# Altium schematic sheet УШЯИ.467444.130Э3_2-A.SchDoc
size 420 x 297 mm; SheetNumber: 2; SheetTotal: 5
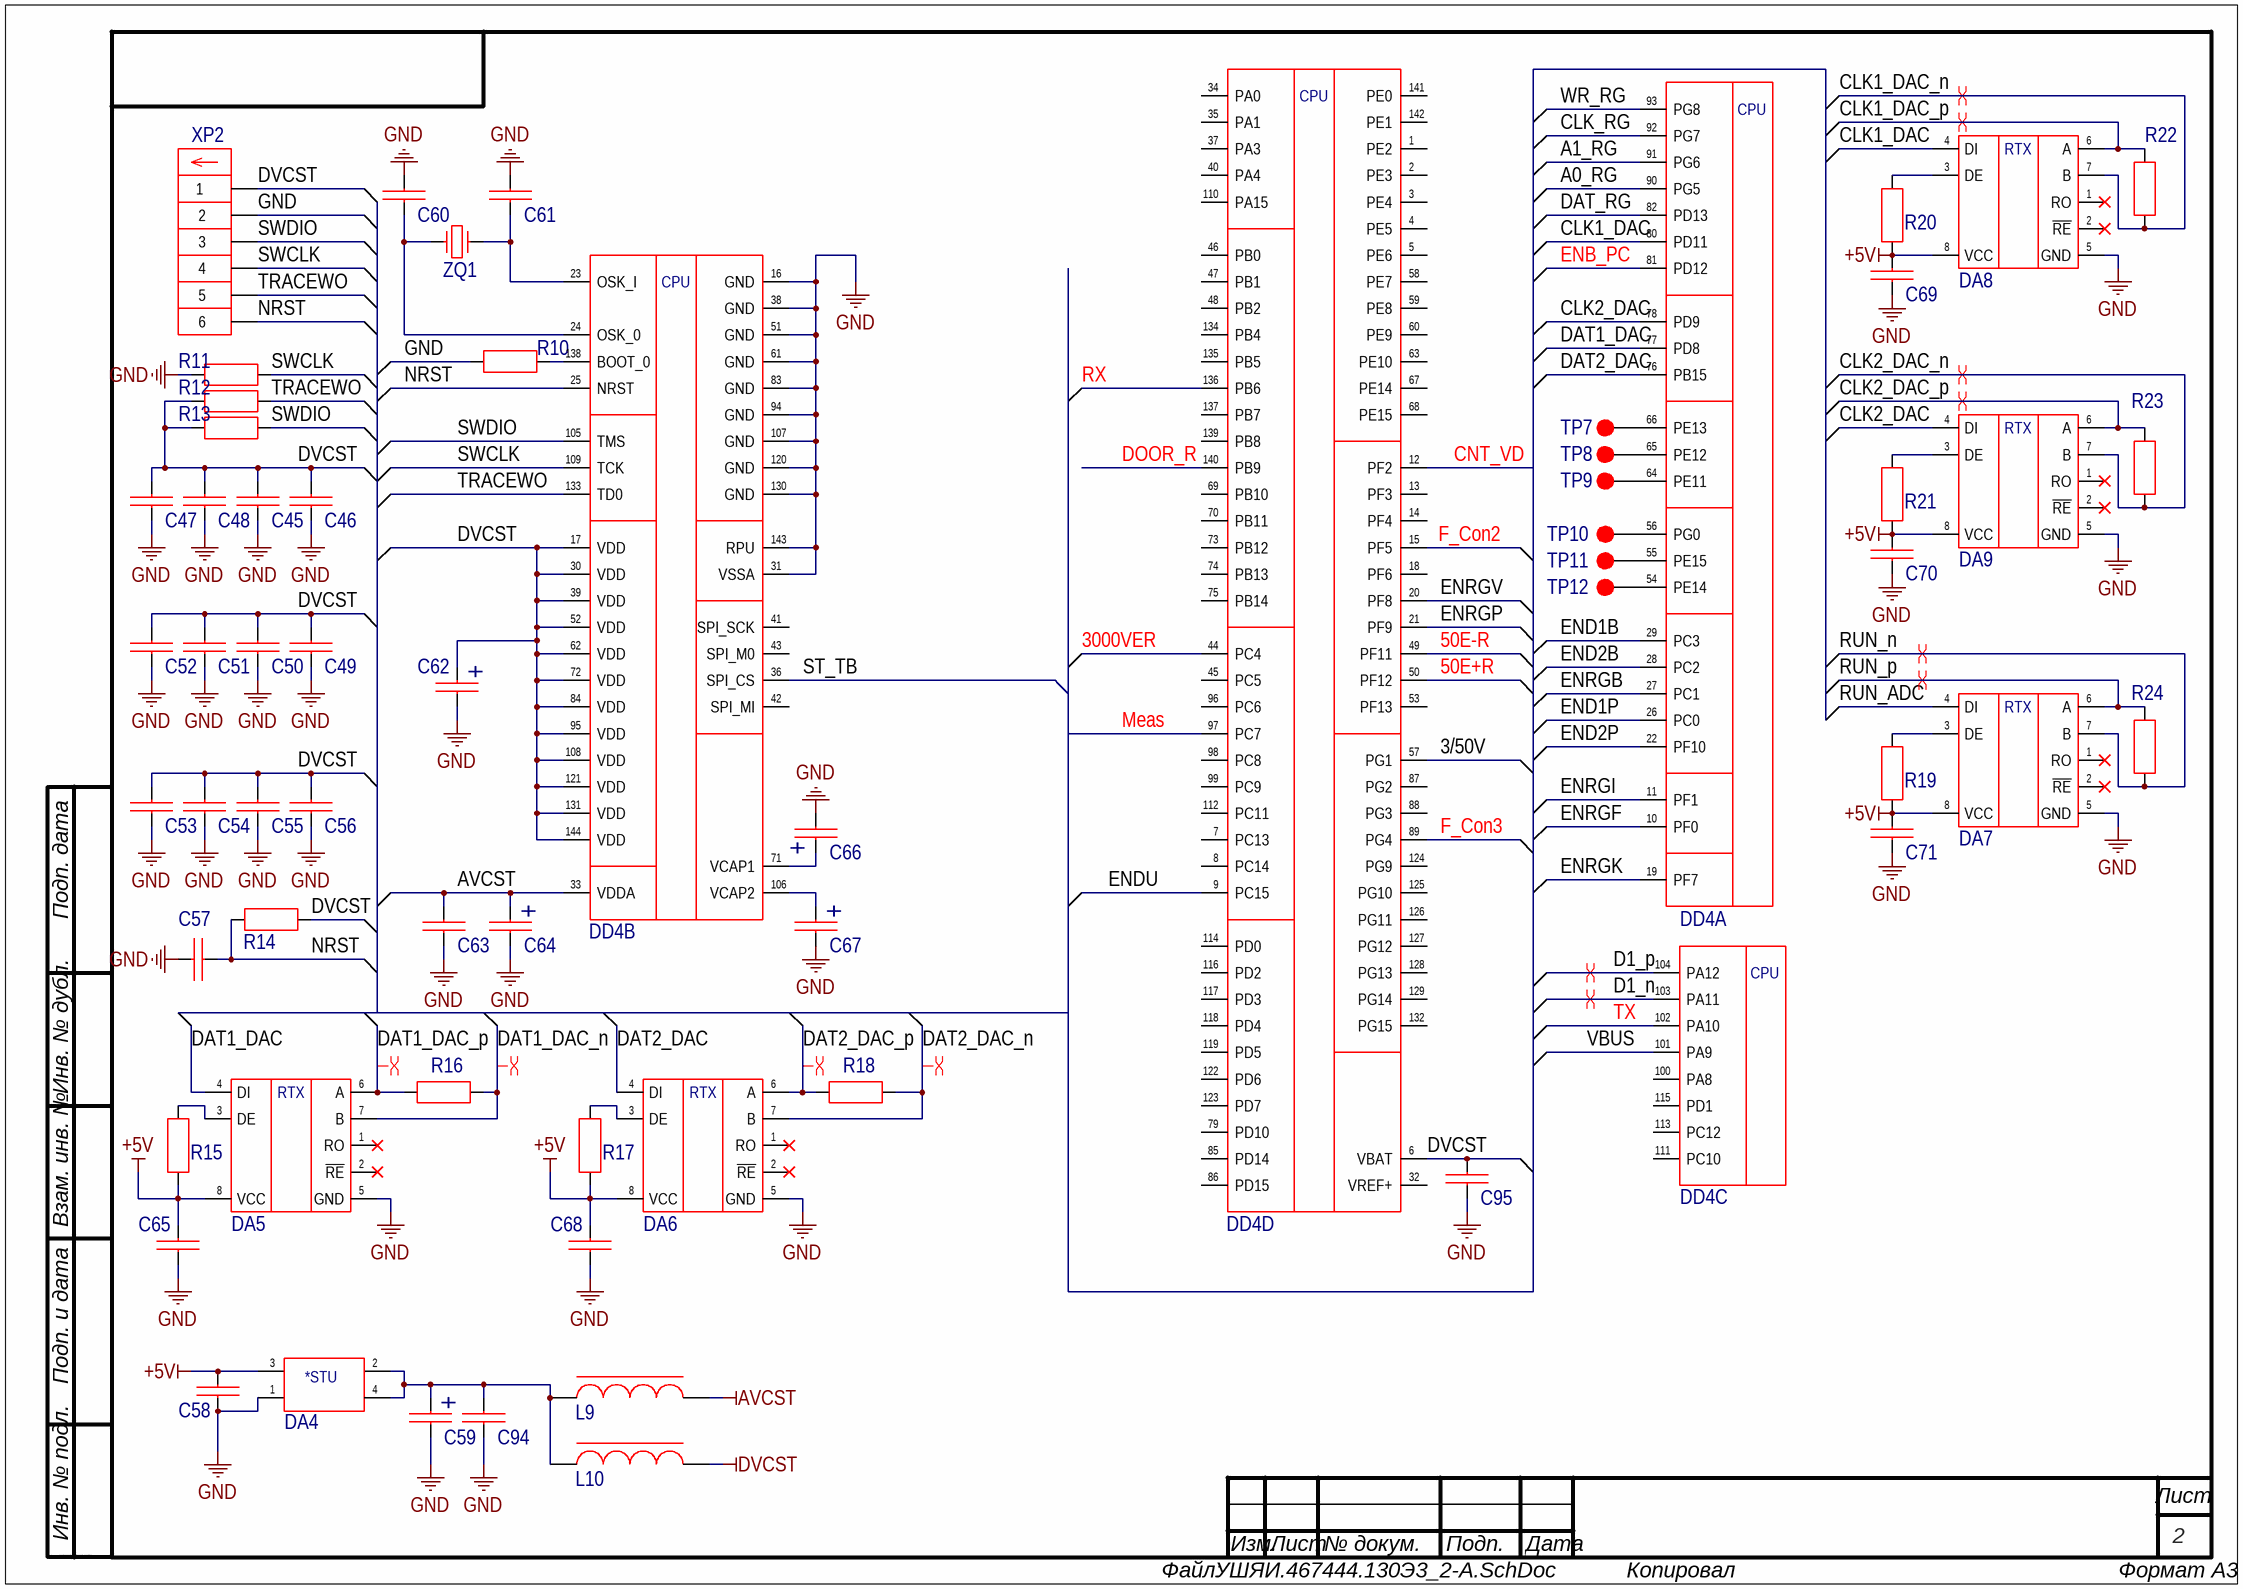
[diagram p0: УШЯИ.467444.130Э3_2-A.SchDoc]

## Parts
C45  0,1 µF  [C_0805 [2012 Metric]]  (value not drawn)
C46  0,1 µF  [C_0805 [2012 Metric]]  (value not drawn)
C47  0,1 µF  [C_0805 [2012 Metric]]  (value not drawn)
C48  0,1 µF  [C_0805 [2012 Metric]]  (value not drawn)
C49  0,1 µF  [C_0805 [2012 Metric]]  (value not drawn)
C50  0,1 µF  [C_0805 [2012 Metric]]  (value not drawn)
C51  0,1 µF  [C_0805 [2012 Metric]]  (value not drawn)
C52  0,1 µF  [C_0805 [2012 Metric]]  (value not drawn)
C53  0,1 µF  [C_0805 [2012 Metric]]  (value not drawn)
C54  0,1 µF  [C_0805 [2012 Metric]]  (value not drawn)
C55  0,1 µF  [C_0805 [2012 Metric]]  (value not drawn)
C56  0,1 µF  [C_0805 [2012 Metric]]  (value not drawn)
C57  0,1 µF  [C_0805 [2012 Metric]]  (value not drawn)
C58  0,1 µF  [C_0805 [2012 Metric]]  (value not drawn)
C59  4,7 µF  [C+_1210 [3528-21 Metric]]  (value not drawn)
C60  20 pF  [C_0805 [2012 Metric]]  (value not drawn)
C61  20 pF  [C_0805 [2012 Metric]]  (value not drawn)
C62  10 µF  [C+_1210 [3528-21 Metric]]  (value not drawn)
C63  0,1 µF  [C_0805 [2012 Metric]]  (value not drawn)
C64  10 µF  [C+_1210 [3528-21 Metric]]  (value not drawn)
C65  0,1 µF  [C_0805 [2012 Metric]]  (value not drawn)
C66  2,2 µF  [C+_1206 [3216-18 Metric]]  (value not drawn)
C67  2,2 µF  [C+_1206 [3216-18 Metric]]  (value not drawn)
C68  0,1 µF  [C_0805 [2012 Metric]]  (value not drawn)
C69  0,1 µF  [C_0805 [2012 Metric]]  (value not drawn)
C70  0,1 µF  [C_0805 [2012 Metric]]  (value not drawn)
C71  0,1 µF  [C_0805 [2012 Metric]]  (value not drawn)
C94  0,1 µF  [C_0805 [2012 Metric]]  (value not drawn)
C95  0,1 µF  [C_0805 [2012 Metric]]  (value not drawn)
DA4  LD1117AS33TR  [SOT-223]  (value not drawn)
DA5  ADM483AR  [SOIC-8_1.27_5x4x1.75]  (value not drawn)
DA6  ADM483AR  [SOIC-8_1.27_5x4x1.75]  (value not drawn)
DA7  ADM483AR  [SOIC-8_1.27_5x4x1.75]  (value not drawn)
DA8  ADM483AR  [SOIC-8_1.27_5x4x1.75]  (value not drawn)
DA9  ADM483AR  [SOIC-8_1.27_5x4x1.75]  (value not drawn)
DD4  STM32F429VIT6STM32F407ZGTx  [QFP-144[20x20]_0.5_22x22x1.6]  (value not drawn)  (parts A,B,C,D of 4)
L9  (no value)  [IND_0805 [2012 Metric]]
L10  (no value)  [IND_0805 [2012 Metric]]
R10  10k  [R_0805 [2012 Metric]]  (value not drawn)
R11  10k  [R_0805 [2012 Metric]]  (value not drawn)
R12  10k  [R_0805 [2012 Metric]]  (value not drawn)
R13  10k  [R_0805 [2012 Metric]]  (value not drawn)
R14  10k  [R_0805 [2012 Metric]]  (value not drawn)
R15  10k  [R_0805 [2012 Metric]]  (value not drawn)
R16  100R  [R_0805 [2012 Metric]]  (value not drawn)
R17  10k  [R_0805 [2012 Metric]]  (value not drawn)
R18  100R  [R_0805 [2012 Metric]]  (value not drawn)
R19  10k  [R_0805 [2012 Metric]]  (value not drawn)
R20  10k  [R_0805 [2012 Metric]]  (value not drawn)
R21  10k  [R_0805 [2012 Metric]]  (value not drawn)
R22  100R  [R_0805 [2012 Metric]]  (value not drawn)
R23  100R  [R_0805 [2012 Metric]]  (value not drawn)
R24  100R  [R_0805 [2012 Metric]]  (value not drawn)
TP7  (no value)  [DSP_1.3]  (no BOM)
TP8  (no value)  [DSP_1.3]  (no BOM)
TP9  (no value)  [DSP_1.3]  (no BOM)
TP10  (no value)  [DSP_1.3]  (no BOM)
TP11  (no value)  [DSP_1.3]  (no BOM)
TP12  (no value)  [DSP_1.3]  (no BOM)
XP2  AMPMODU II 280372-2  [AMP II-280372-2]  (value not drawn)
ZQ1  Q 25.0JXS63-12-30/30-FU  [JXS63]  (value not drawn)

## Nets
+5V: C58.1 C65.2 C68.2 C69.2 C70.2 C71.2 DA4.3(VIN) DA5.8(VCC) DA6.8(VCC) DA7.8(VCC) DA8.8(VCC) DA9.8(VCC) R15.1 R17.1 R19.1 R20.1 R21.1
AVCST: C63.2 C64.+ DD4.33(VDDA) L9.2
DVCST: C45.2 C46.2 C47.2 C48.2 C49.2 C50.2 C51.2 C52.2 C53.2 C54.2 C55.2 C56.2 C62.+ C95.2 DD4.6(VBAT) DD4.17(VDD) DD4.30(VDD) DD4.39(VDD) DD4.52(VDD) DD4.62(VDD) DD4.72(VDD) DD4.84(VDD) DD4.95(VDD) DD4.108(VDD) DD4.121(VDD) DD4.131(VDD) DD4.144(VDD) L10.2 R12.1 R13.1 R14.1 XP2.1
GND: C45.1 C46.1 C47.1 C48.1 C49.1 C50.1 C51.1 C52.1 C53.1 C54.1 C55.1 C56.1 C57.1 C58.2 C59.- C60.2 C61.2 C62.- C63.1 C64.- C65.1 C66.- C67.- C68.1 C69.1 C70.1 C71.1 C94.1 C95.1 DA4.1(ADJ/GND) DA5.5(GND) DA6.5(GND) DA7.5(GND) DA8.5(GND) DA9.5(GND) DD4.16(GND) DD4.31(VSSA) DD4.38(GND) DD4.51(GND) DD4.61(GND) DD4.83(GND) DD4.94(GND) DD4.107(GND) DD4.120(GND) DD4.130(GND) DD4.143(RPU) R10.1 R11.1 XP2.2
3/50V: DD4.57(PG1)
50E+R: DD4.50(PF12)
50E-R: DD4.49(PF11)
3000VER: DD4.44(PC4)
A0_RG: DD4.90(PG5)
A1_RG: DD4.91(PG6)
CLK1_DAC: DA8.4(DI) DD4.80(PD11)
CLK1_DAC_n: DA8.7(B) R22.1
CLK1_DAC_p: DA8.6(A) R22.2
CLK2_DAC: DA9.4(DI) DD4.78(PD9)
CLK2_DAC_n: DA9.7(B) R23.1
CLK2_DAC_p: DA9.6(A) R23.2
CLK_RG: DD4.92(PG7)
CNT_VD: DD4.12(PF2)
D1_n: DD4.103(PA11)
D1_p: DD4.104(PA12)
DAT1_DAC: DA5.4(DI) DD4.77(PD8)
DAT1_DAC_n: DA5.7(B) R16.2
DAT1_DAC_p: DA5.6(A) R16.1
DAT2_DAC: DA6.4(DI) DD4.76(PB15)
DAT2_DAC_n: DA6.7(B) R18.2
DAT2_DAC_p: DA6.6(A) R18.1
DAT_RG: DD4.82(PD13)
DOOR_R: DD4.140(PB9)
ENB_PC: DD4.81(PD12)
END1B: DD4.29(PC3)
END1P: DD4.26(PC0)
END2B: DD4.28(PC2)
END2P: DD4.22(PF10)
ENDU: DD4.9(PC15)
ENRGB: DD4.27(PC1)
ENRGF: DD4.10(PF0)
ENRGI: DD4.11(PF1)
ENRGK: DD4.19(PF7)
ENRGP: DD4.21(PF9)
ENRGV: DD4.20(PF8)
F_Con2: DD4.15(PF5)
F_Con3: DD4.89(PG4)
Meas: DD4.97(PC7)
NRST: C57.2 DD4.25(NRST) R14.2 XP2.6
RUN_ADC: DA7.4(DI)
RUN_n: DA7.7(B) R24.1
RUN_p: DA7.6(A) R24.2
RX: DD4.136(PB6)
ST_TB: DD4.36(SPI_CS)
SWCLK: DD4.109(TCK) R11.2 XP2.4
SWDIO: DD4.105(TMS) R13.2 XP2.3
TRACEWO: DD4.133(TD0) R12.2 XP2.5
TX: DD4.102(PA10)
VBUS: DD4.101(PA9)
WR_RG: DD4.93(PG8)
NetC59_+: C59.+ C94.2 DA4.2(VOUT) DA4.4(VOUT) L9.1 L10.1
NetC60_1: C60.1 DD4.24(OSK_0) ZQ1.1
NetC61_1: C61.1 DD4.23(OSK_I) ZQ1.3
NetC66_+: C66.+ DD4.71(VCAP1)
NetC67_+: C67.+ DD4.106(VCAP2)
NetDA5_3: DA5.3(DE) R15.2
NetDA6_3: DA6.3(DE) R17.2
NetDA7_3: DA7.3(DE) R19.2
NetDA8_3: DA8.3(DE) R20.2
NetDA9_3: DA9.3(DE) R21.2
NetDD4_54: DD4.54(PE14) TP12.1
NetDD4_55: DD4.55(PE15) TP11.1
NetDD4_56: DD4.56(PG0) TP10.1
NetDD4_64: DD4.64(PE11) TP9.1
NetDD4_65: DD4.65(PE12) TP8.1
NetDD4_66: DD4.66(PE13) TP7.1
NetDD4_138: DD4.138(BOOT_0) R10.2

Not connected (* = marked no-connect by the designer): DA5 1(RO)* 2(~{RE})*; DA6 1(RO)* 2(~{RE})*; DA7 1(RO)* 2(~{RE})*; DA8 1(RO)* 2(~{RE})*; DA9 1(RO)* 2(~{RE})*; DD4 1(PE2) 2(PE3) 3(PE4) 4(PE5) 5(PE6) 7(PC13) 8(PC14) 13(PF3) 14(PF4) 18(PF6) 32(VREF+) 34(PA0) 35(PA1) 37(PA3) 40(PA4) 41(SPI_SCK) 42(SPI_MI) 43(SPI_M0) 45(PC5) 46(PB0) 47(PB1) 48(PB2) 53(PF13) 58(PE7) 59(PE8) 60(PE9) 63(PE10) 67(PE14) 68(PE15) 69(PB10) 70(PB11) 73(PB12) 74(PB13) 75(PB14) 79(PD10) 85(PD14) 86(PD15) 87(PG2) 88(PG3) 96(PC6) 98(PC8) 99(PC9) 100(PA8) 110(PA15) 111(PC10) 112(PC11) 113(PC12) 114(PD0) 115(PD1) 116(PD2) 117(PD3) 118(PD4) 119(PD5) 122(PD6) 123(PD7) 124(PG9) 125(PG10) 126(PG11) 127(PG12) 128(PG13) 129(PG14) 132(PG15) 134(PB4) 135(PB5) 137(PB7) 139(PB8) 141(PE0) 142(PE1)

## Layout directives
differential pair: CLK1_DAC_n, CLK1_DAC_p, CLK2_DAC_n, CLK2_DAC_p, D1_n, D1_p, DAT1_DAC_n, DAT1_DAC_p, DAT2_DAC_n, DAT2_DAC_p, RUN_n, RUN_p

## Notes on the sheet
- Подп. дата
- Инв. № дубл.
- Взам. инв. №
- Подп. и дата
- Инв. № подл.
- Изм.
- Лист
- № докум.
- Подп.
- Дата
- ALTIUM GOSTBOM2.0 KEV
- Файл:
- Копировал
- Формат А3
- (in symbol IC_1) *STU
- (in symbol IC_11) RTX
- (in symbol IC_15, part A) CPU
- (in symbol IC_15, part B) CPU
- (in symbol IC_15, part C) CPU
- (in symbol IC_15, part D) CPU

## Library data of the parts
C45-C58 C63 C65 C68-C71 C95 = Cap_60: Неполярный конденсатор; Manufacturer: Murata; ID: Cap_60; Component Name: Конденсатор GRM21BR71H104KA01L; Voltage: 50V; Tolerance: ±10%; Datasheet: https://www.murata.com/en-eu/products/productdetail?partno=GRM21BR71H104KA01%23; Capacitance: 0,1 µF; Case / Package: 0805 [2012 Metric]; Height: 1.4mm; Weight, kg: 0,000006
  C69: ClassName: DA8
  C70: ClassName: DA9
  C71: ClassName: DA7
C59 = Cap_14: Полярный конденсатор; Manufacturer: KYOCERA AVX; ID: Cap_14; Component Name: Конденсатор TAJB475K020; Voltage: 20V / 10V; Tolerance: ±10%; Datasheet: https://datasheets.kyocera-avx.com/TAJ.pdf; Capacitance: 4,7 µF; Case / Package: 1210 [3528-21 Metric]; Height: 2mm; Weight, kg: 0,000016
C60 C61 = Cap_69: Неполярный конденсатор; Manufacturer: Murata; ID: Cap_69; Component Name: Конденсатор GRM2165C1H200J; Voltage: 50V; Tolerance: ±5%; Datasheet: chrome-extension://efaidnbmnnnibpcajpcglclefindmkaj/https://static.chipdip.ru/lib/235/DOC000235066.pdf; Capacitance: 20 pF; Case / Package: 0805 [2012 Metric]; Height: 1.4mm; Weight, kg: 0,000006
C62 C64 = Cap_56: Полярный конденсатор; Manufacturer: KYOCERA AVX; ID: Cap_56; Component Name: Конденсатор TAJB106M020; Voltage: 20V / 10V; Tolerance: ±20%; Datasheet: https://datasheets.kyocera-avx.com/TAJ.pdf; Capacitance: 10 µF; Case / Package: 1210 [3528-21 Metric]; Height: 2mm; Weight, kg: 0,000016
C66 C67 = Cap_16: Полярный конденсатор; Manufacturer: AVX; ID: Cap_16; Component Name: Конденсатор TAJA225M016; Voltage: 16V / 10V; Tolerance: ±20%; Datasheet: https://datasheets.kyocera-avx.com/TAJ.pdf; Capacitance: 2,2 µF; Case / Package: 1206 [3216-18 Metric]; Height: 1.7mm; Weight, kg: 0,000016
C94 = Cap_97: Неполярный конденсатор; Manufacturer: Murata; ID: Cap_97; Component Name: Конденсатор GRM21BR71E104KA01L; Voltage: 25V; Tolerance: ±10%; Catalogue: CHIPDIP 9000121574; Datasheet: https://static.chipdip.ru/lib/250/DOC000250694.pdf; Capacitance: 0,1 µF; Case / Package: 0805 [2012 Metric]; Height: 1.4mm; Weight, kg: 0,000006
DA4 = IC_1: IC, Fixed LDO Voltage Regulator, 5.3V to 10V, 1.15V Dropout, 3.3Vout, 1Aout; Manufacturer: STMicroelectronics; ID: IC_1; Component Name: Микросхема LD1117AS33TR; Catalogue: DIGI-KEY 497-1228-2-ND; Device: LD1117AS33TR; Datasheet: https://www.st.com/content/ccc/resource/technical/document/datasheet/a5/c3/3f/c9/2b/15/40/49/CD00002116.pdf/files/CD00002116.pdf/jcr:content/translations/en.CD00002116.pdf; Case / Package: SOT-223; Height: 1.9mm; Weight, kg: 0,0045
DA5-DA9 = IC_11: IC, Transceiver, RS422/RS485, 1 Driver, 1 Receiver, 4.75 V to 5.25 V, -40°C to 125°C; Manufacturer: Analog Devices; ID: IC_11; Component Name: Микросхема ADM483AR; Device: ADM483AR; Datasheet: https://www.analog.com/media/en/technical-documentation/data-sheets/ADM383.pdf; Case / Package: SOIC-8; Height: 1.75mm; Weight, kg: 0,0002
  DA7: ClassName: DA7
  DA8: ClassName: DA8
  DA9: ClassName: DA9
DD4 = IC_15: IC, ARM Cortex-M4, 168 MHz, 1 MB ROM, 192 kB RAM, -40°C to 85°C; Manufacturer: STMicroelectronics; ID: IC_15; Component Name: Микросхема STM32F407ZGTx; Device: STM32F429VIT6STM32F407ZGTx; Datasheet: https://www.st.com/resource/en/datasheet/dm00037051.pdf; Case / Package: 144-QFP (20x20); Height: 1.6mm; Weight, kg: 0,0011
L9 L10 = Ind_5: Manufacturer: Vishay; ID: Ind_5; Component Name: Фильтр ферритовый ILBB0805ER601V; Isat: 200mA; Resistance: 300 mOhm; Tolerance: ±25%; Catalogue: DIGI-KEY 541-2297-1-ND; Datasheet: https://www.vishay.com/docs/34025/ilbb0805.pdf; Case / Package: 0805 [2012 Metric]; Height: 1.1mm; Weight, kg: 0,00006
R10-R15 R17 R19-R21 = Res_5: ID: Res_5; Component Name: Резистор 0805-10 кОм ±5%; Tolerance: ±5%; Resistance: 10k; Case / Package: 0805 [2012 Metric]; Height: 0.7mm; Weight, kg: 0,000006
  R19: ClassName: DA7
  R20: ClassName: DA8
  R21: ClassName: DA9
R16 R18 R22-R24 = Res_10: ID: Res_10; Component Name: Резистор 0805-100 Ом ±5%; Tolerance: ±5%; Resistance: 100R; Case / Package: 0805 [2012 Metric]; Height: 0.7mm; Weight, kg: 0,000006
  R22: ClassName: DA8
  R23: ClassName: DA9
  R24: ClassName: DA7
TP7-TP12 = Pad_13: ID: Pad_13; Component Name: TP_DSP_1.3
XP2 = Conn_2: Male, 6 pin, 1 row, Vertical, Board-to-Board, 2.54 mm; Manufacturer: TE Connectivity; ID: Conn_2; Component Name: Вилка AMPMODU II 280372-2; Catalogue: TE Internal 280372-2; Крепёж: Не нужно; Device: AMPMODU II 280372-2; Datasheet: https://www.te.com/usa-en/product-280372-2.datasheet.pdf; Height: 12.8mm; Weight, kg: 0,0013
ZQ1 = Rez_1: Manufacturer: Jauch Quartz GmbH; ID: Rez_1; Component Name: Резонатор Q 25.0JXS63-12-30/30-FU; Frequency: 25MHz; Device: Q 25.0JXS63-12-30/30-FU; Datasheet: https://www.jauch.com/downloadfile/57fdedace792c_938dbcb9dba48037cc0e/jxs63-200613.pdf; Height: 1mm; Weight, kg: 0,001